# EasyEDA schematic SCH_PrimoCart_r6.json
TITLE: Program Cart Module for Primo; REV: 1.0; Date: 2021-09-22; Sheet: 1/1; Drawn By: Sándor Vass; Company: Your Company
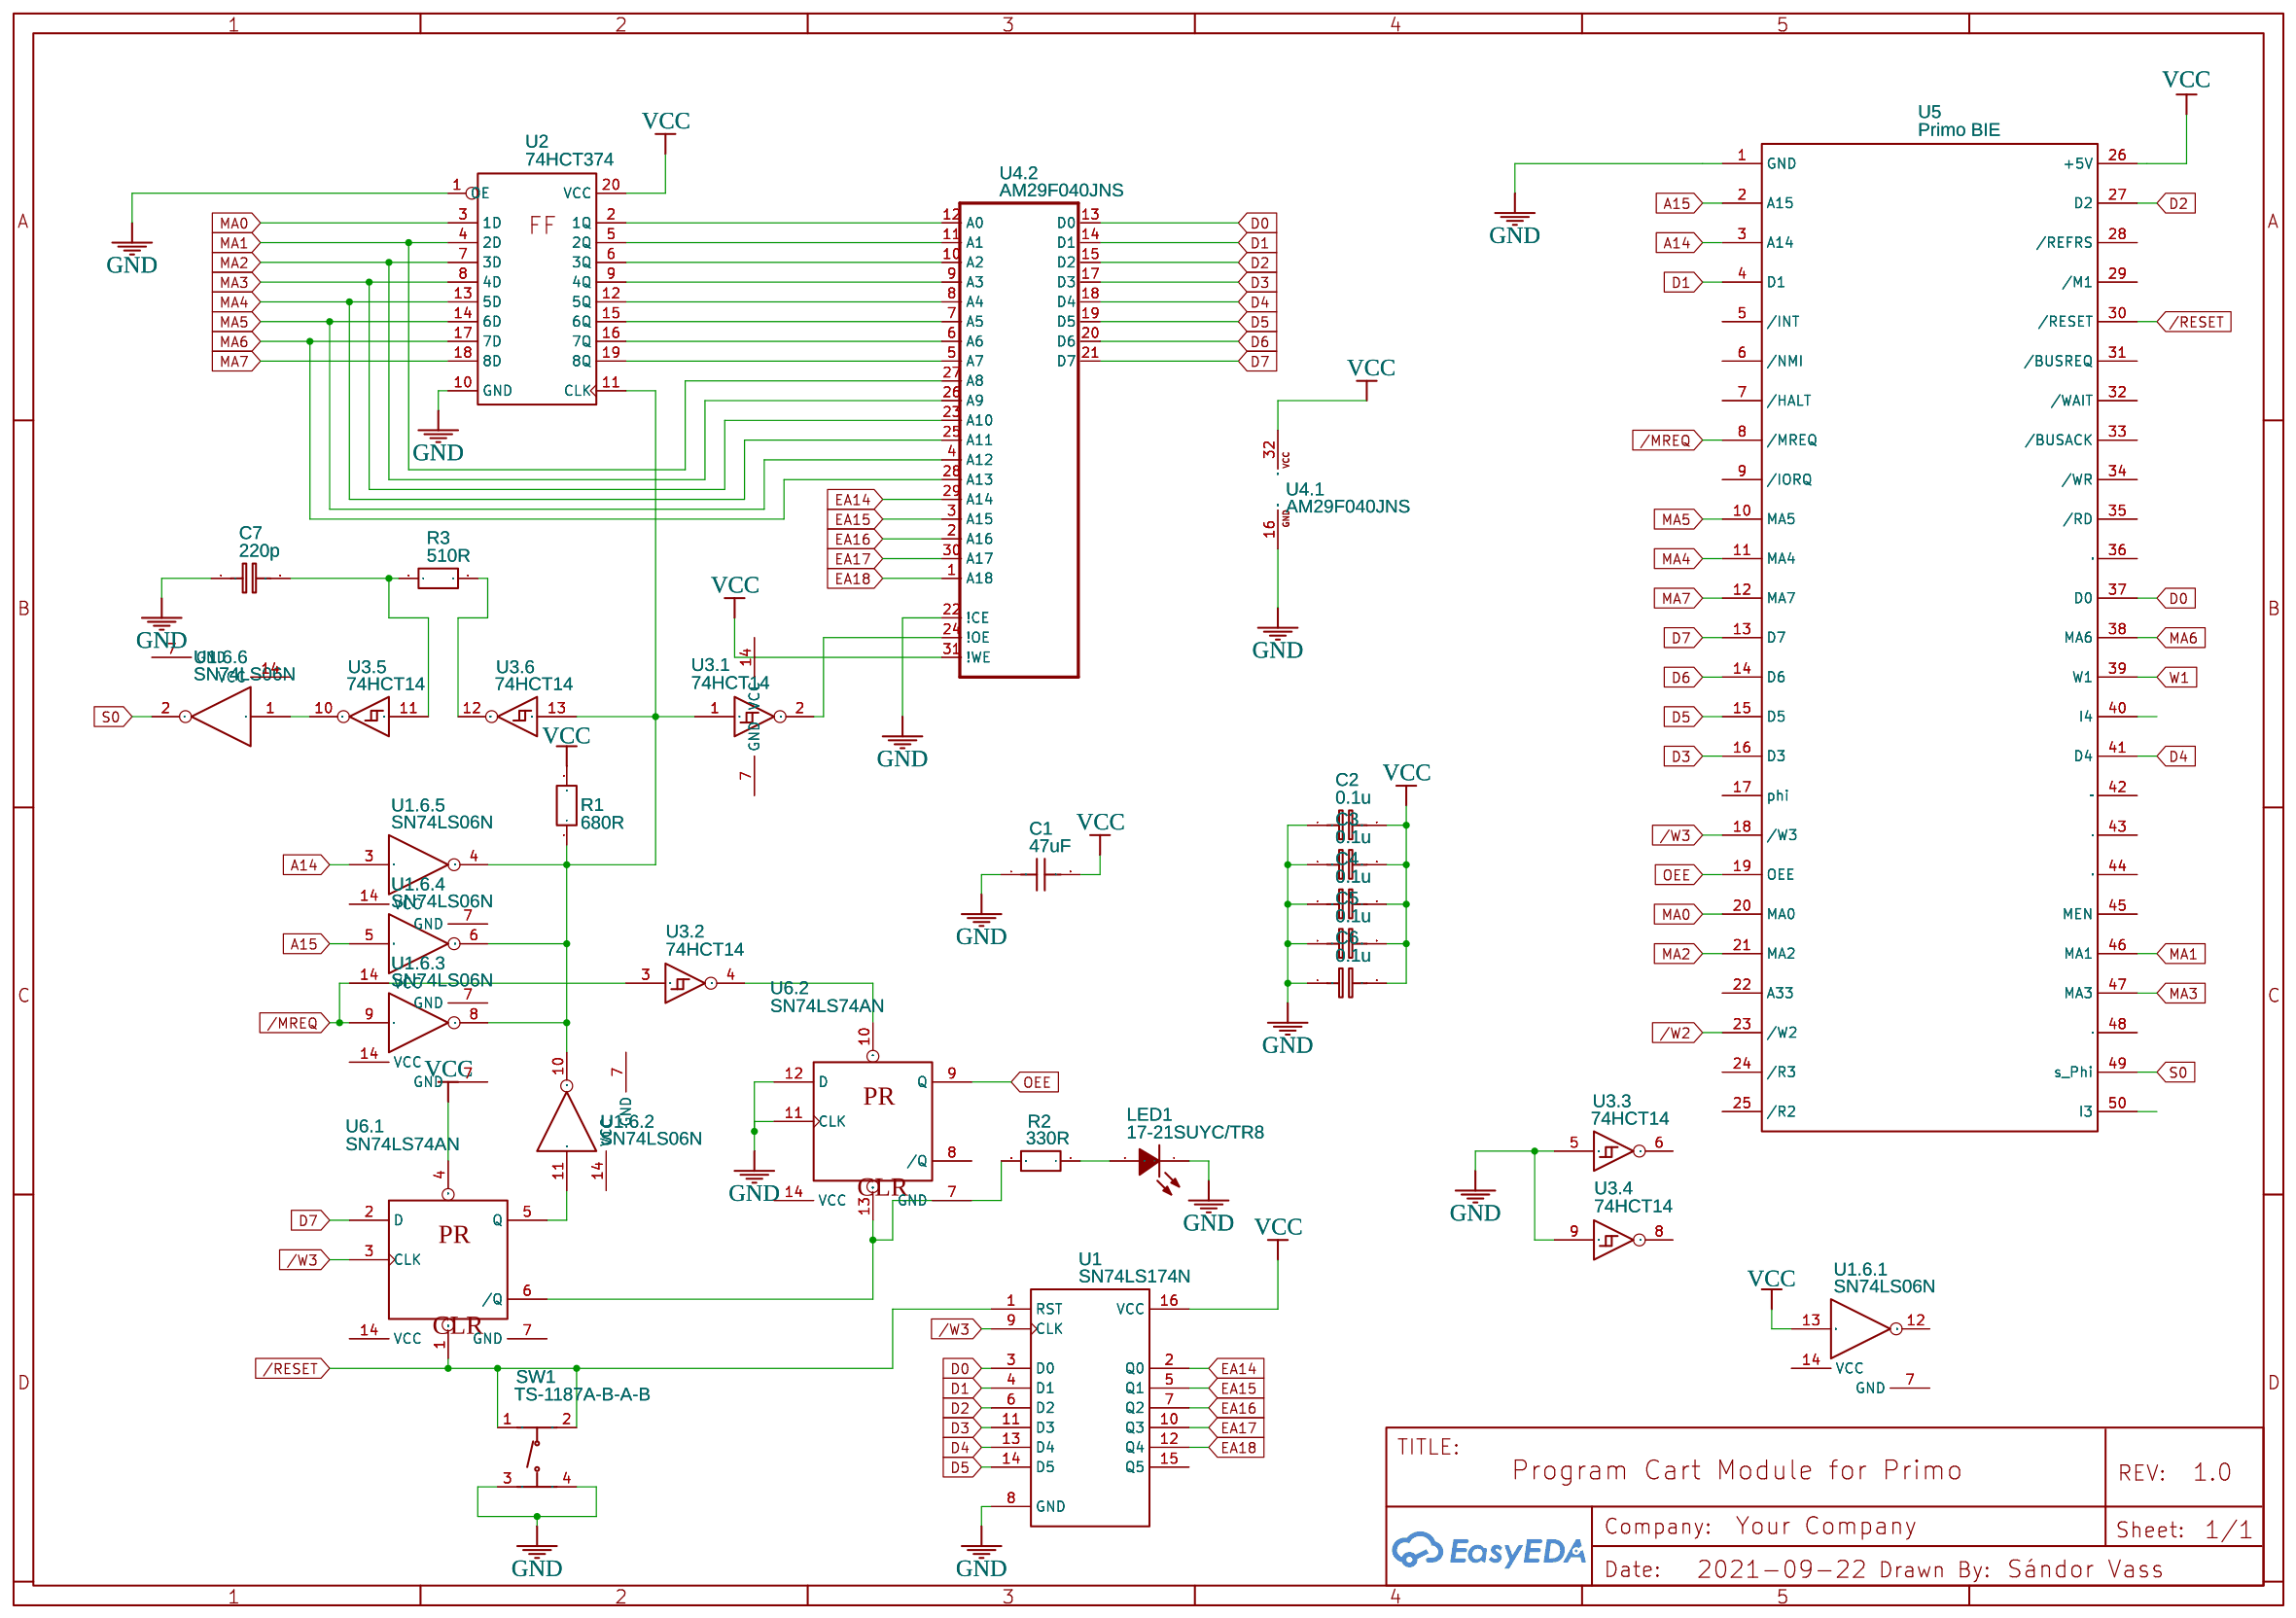
[diagram p0: schematic sheet]

## Parts
C1  47uF  [C1206]
C2  0.1u  [C0805]
C3  0.1u  [C0805]
C4  0.1u  [C0805]
C5  0.1u  [C0805]
C6  0.1u  [C0805]
C7  220p  [C0805]
LED1  17-21SUYC/TR8  [LED0805-RD]
R1  680R  [R0805]
R2  330R  [R0805]
R3  510R  [R0805]
SW1  TS-1187A-B-A-B  [SW-SMD_4P-L5.1-W5.1-P3.70-LS6.5-TL-2]
U1  SN74LS174N  [SOIC-16_L9.9-W3.9-P1.27-LS6.1-BL]
U1.6  SN74LS06N  [SOIC-14_L8.6-W3.9-P1.27-LS6.0-BL]  (sections 1,2,3,4,5,6)
U2  74HCT374  [SOIC-20_L12.8-W7.5-P1.27-LS10.3-TL]
U3  74HCT14  [SOIC-14_L8.6-W3.8-P1.27-LS6.0-BL]  (sections 1,2,3,4,5,6)
U4  AM29F040JNS  [PLCC32R-NS]  (sections 1,2)
U5  Primo BIE  [PRIMO BIE]
U6  SN74LS74AN  [SOIC-14_L8.7-W3.9-P1.27-LS6.0-BL]  (sections 1,2)

## Library data of the parts
C1 = CL31A476MPHNNNE: Supplier: LCSC; Manufacturer: SAMSUNG; Supplier Part: C96123; JLCPCB Part Class: Basic Part; Package Display: No
C2-C6 = C_RAD-0.1_EU: Supplier Part: C49678; Supplier: LCSC; Contributor: LCEDA_Lib; Manufacturer Part: CC0805KRX7R9BB104; Manufacturer: YAGEO
C7 = C_RAD-0.1_EU: Supplier Part: C53172; Supplier: LCSC; Contributor: LCEDA_Lib; Manufacturer Part: CL21B221KBANNNC; Manufacturer: YAGEO; Package Display: No
LED1 = 17-21SUYC/TR8: Supplier: LCSC; Manufacturer: KENTO; Manufacturer Part: 0805G (Green); Supplier Part: C2297; JLCPCB Part Class: Basic Part; Package Display: No
R1 = R_AXIAL-0.3_EU: Supplier Part: C17798; Supplier: LCSC; Contributor: LCEDA_Lib; Manufacturer Part: 0805W8F6800T5E; Manufacturer: UniOhm
R2 = R_AXIAL-0.3_EU: Supplier Part: C17630; Supplier: LCSC; Contributor: LCEDA_Lib; Manufacturer Part: 0805W8F3300T5E; Package Display: No; Manufacturer: UNI-ROYAL(Uniroyal Elec)
R3 = R_AXIAL-0.3_EU: Supplier Part: C17734; Supplier: LCSC; Contributor: LCEDA_Lib; Manufacturer Part: 0805W8F5100T5E; Manufacturer: UniOhm; Package Display: No
SW1 = TS-1187A-B-A-B: Supplier: LCSC; Supplier Part: C318884; Manufacturer: XKB Enterprise; Contributor: LCSC; JLCPCB Part Class: Extended Part
U1 = SN74LS174N: Hex D-Type Flip-Flop; Manufacturer Part: SN74LS174DR; Supplier: LCSC; Manufacturer: TI; Supplier Part: C7744
U1.6 = SN74LS06N: Hex Inverters Buffers  Drivers with Open Collector High-Voltage Outputs; subpart_no: 6; Manufacturer Part: SN74LS06DR; Package Display: No; Supplier: LCSC; Supplier Part: C113682; Manufacturer: Texas Instruments
U2 = 74HCT374: Package Display: No; Supplier: LCSC; Supplier Part: C184172
U3 = 74HCT14: Manufacturer: TI; Manufacturer Part: SN74HCT14DR; Supplier Part: C6769; Supplier: LCSC; Contributor: stormbolter; subpart_no: 1; Package Display: No
U4 = AM29F040JNS: Contributor: thomas.christopher568; subpart_no: 2; Package Display: No; Supplier: LCSC; Supplier Part: C72257
U5 = Primo BIE: Contributor: vass.sanyi
U6 = SN74LS74AN: Dual D-Type Positive Edge-Triggered Flip-Flop; subpart_no: 1; Manufacturer Part: MC74HCT74ADG; Package Display: No; Supplier: LCSC; Supplier Part: C184777; Manufacturer: ON Semiconductor

## Nets
GND: C1.1 C2.1 C3.1 C4.1 C5.1 C6.1 C7.1 LED1.1(-) SW1.3(C) SW1.4(D) U1.8(GND) U2.1(OE) U2.10(GND) U3.5(3A) U3.9(4A) U4.16(GND) U4.22(!CE) U5.1(GND) U6.11(CLK) U6.12(D)
VCC: C1.2 C2.2 C3.2 C4.2 C5.2 C6.2 R1.2 U1.16(VCC) U1.6.13(6A) U2.20(VCC) U4.31(!WE) U4.32(VCC) U5.26(+5V) U6.4(PR)
/MREQ: U1.6.9(4A) U3.3(2A) U5.8(/MREQ)
/RESET: SW1.1(A) SW1.2(B) U1.1(RST) U5.30(/RESET) U6.1(CLR)
/W2: U5.23(/W2)
/W3: U1.9(CLK) U5.18(/W3) U6.3(CLK)
A14: U1.6.3(2A) U5.3(A14)
A15: U1.6.5(3A) U5.2(A15)
D0: U1.3(D0) U4.13(D0) U5.37(D0)
D1: U1.4(D1) U4.14(D1) U5.4(D1)
D2: U1.6(D2) U4.15(D2) U5.27(D2)
D3: U1.11(D3) U4.17(D3) U5.16(D3)
D4: U1.13(D4) U4.18(D4) U5.41(D4)
D5: U1.14(D5) U4.19(D5) U5.15(D5)
D6: U4.20(D6) U5.14(D6)
D7: U4.21(D7) U5.13(D7) U6.2(D)
EA14: U1.2(Q0) U4.29(A14)
EA15: U1.5(Q1) U4.3(A15)
EA16: U1.7(Q2) U4.2(A16)
EA17: U1.10(Q3) U4.30(A17)
EA18: U1.12(Q4) U4.1(A18)
MA0: U2.3(1D) U5.20(MA0)
MA1: U2.4(2D) U4.27(A8) U5.46(MA1)
MA2: U2.7(3D) U4.26(A9) U5.21(MA2)
MA3: U2.8(4D) U4.23(A10) U5.47(MA3)
MA4: U2.13(5D) U4.25(A11) U5.11(MA4)
MA5: U2.14(6D) U4.4(A12) U5.10(MA5)
MA6: U2.17(7D) U4.28(A13) U5.38(MA6)
MA7: U2.18(8D) U5.12(MA7)
OEE: U5.19(OEE) U6.9(Q)
S0: U1.6.2(1Y) U5.49(s Phi)
W1: U5.39(W1)
Net-(C7-2): C7.2 R3.2 U3.11(5A)
Net-(LED1-2): LED1.2(+) R2.1
Net-(R1-1): R1.1 U1.6.4(2Y) U1.6.6(3Y) U1.6.8(4Y) U1.6.10(5Y) U2.11(CLK) U3.1(1A) U3.13(6A)
Net-(R2-2): R2.2 U6.6(/Q) U6.13(CLR)
Net-(R3-1): R3.1 U3.12(6Y)
Net-(U1.6.2-11): U1.6.11(5A) U6.5(Q)
Net-(U1.6.6-1): U1.6.1(1A) U3.10(5Y)
Net-(U2-2): U2.2(1Q) U4.12(A0)
Net-(U2-5): U2.5(2Q) U4.11(A1)
Net-(U2-6): U2.6(3Q) U4.10(A2)
Net-(U2-9): U2.9(4Q) U4.9(A3)
Net-(U2-12): U2.12(5Q) U4.8(A4)
Net-(U2-15): U2.15(6Q) U4.7(A5)
Net-(U2-16): U2.16(7Q) U4.6(A6)
Net-(U2-19): U2.19(8Q) U4.5(A7)
Net-(U3.1-2): U3.2(1Y) U4.24(!OE)
Net-(U3.2-4): U3.4(2Y) U6.10(PR)

Not connected (* = marked no-connect by the designer): U1 15(Q5); U1.6 7(GND) 12(6Y) 14(VCC); U3 6(3Y) 7(GND) 8(4Y) 14(VCC); U5 5(/INT) 6(/NMI) 7(/HALT) 9(/IORQ) 17(phi) 22(A33) 24(/R3) 25(/R2) 28(/REFRS) 29(/M1) 31(/BUSREQ) 32(/WAIT) 33(/BUSACK) 34(/WR) 35(/RD) 36(bob) 40(I4) 42("") 43(D18) 44(D19) 45(MEN) 48(D23) 50(I3); U6 7(GND) 8(/Q) 14(VCC)
